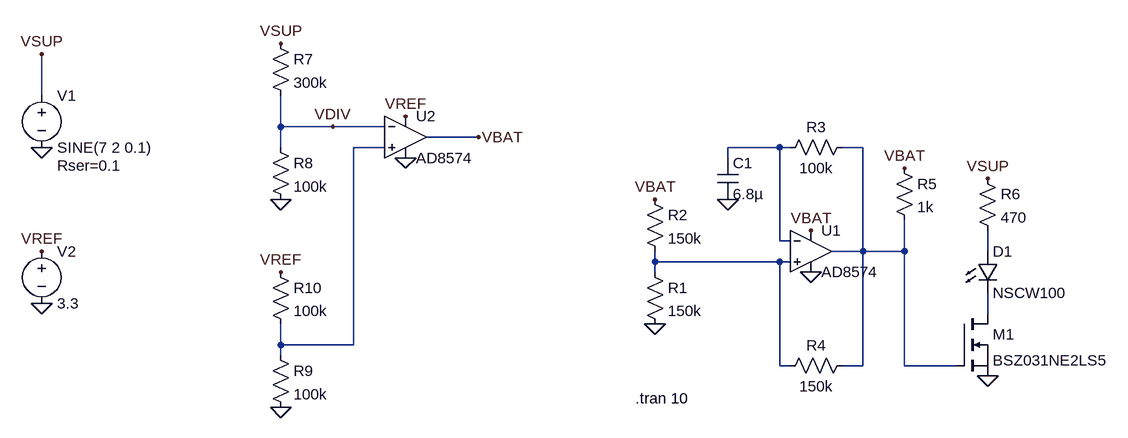
[diagram p0: schematic Low Battery.asc]
Low Battery.asc, the LTspice schematic file:
Version 4
SHEET 1 880 680
WIRE -992 -64 -992 -128
WIRE -624 -16 -624 -64
WIRE -544 -16 -624 -16
WIRE -464 -16 -544 -16
WIRE -320 0 -400 0
WIRE -624 16 -624 -16
WIRE -464 16 -512 16
WIRE 144 16 64 16
WIRE 160 16 144 16
WIRE 272 16 240 16
WIRE 64 32 64 16
WIRE 144 160 144 16
WIRE 160 160 144 160
WIRE 272 176 272 16
WIRE 272 176 224 176
WIRE 336 176 336 128
WIRE 336 176 272 176
WIRE 464 176 464 144
WIRE -48 192 -48 176
WIRE 144 192 -48 192
WIRE 160 192 144 192
WIRE -48 208 -48 192
WIRE 464 272 464 240
WIRE -624 320 -624 288
WIRE -512 320 -512 16
WIRE -512 320 -624 320
WIRE -624 336 -624 320
WIRE 144 352 144 192
WIRE 160 352 144 352
WIRE 272 352 272 176
WIRE 272 352 240 352
WIRE 336 352 336 176
WIRE 416 352 336 352
FLAG -48 288 0
FLAG 64 96 0
FLAG -48 96 VBAT
FLAG 192 144 VBAT
FLAG 192 208 0
FLAG 336 48 VBAT
FLAG -992 16 0
FLAG -992 -128 VSUP
FLAG 464 368 0
FLAG 464 64 VSUP
FLAG -992 256 0
FLAG -992 176 VREF
FLAG -624 96 0
FLAG -432 -32 VREF
FLAG -432 32 0
FLAG -624 -144 VSUP
FLAG -320 0 VBAT
FLAG -544 -16 VDIV
FLAG -624 416 0
FLAG -624 208 VREF
SYMBOL res -64 192 R0
SYMATTR InstName R1
SYMATTR Value 150k
SYMBOL res -64 80 R0
SYMATTR InstName R2
SYMATTR Value 150k
SYMBOL res 256 0 R90
WINDOW 0 0 56 VBottom 2
WINDOW 3 32 56 VTop 2
SYMATTR InstName R3
SYMATTR Value 100k
SYMBOL res 256 336 R90
WINDOW 0 0 56 VBottom 2
WINDOW 3 32 56 VTop 2
SYMATTR InstName R4
SYMATTR Value 150k
SYMBOL res 320 32 R0
SYMATTR InstName R5
SYMATTR Value 1k
SYMBOL cap 48 32 R0
SYMATTR InstName C1
SYMATTR Value 6.8µ
SYMBOL voltage -992 -80 R0
WINDOW 123 0 0 Left 0
WINDOW 39 24 124 Left 2
SYMATTR InstName V1
SYMATTR Value SINE(7 2 0.1)
SYMATTR SpiceLine Rser=0.1
SYMBOL OpAmps\\AD8574 192 112 R0
SYMATTR InstName U1
SYMBOL nmos 416 272 R0
SYMATTR InstName M1
SYMATTR Value BSZ031NE2LS5
SYMBOL LED 448 176 R0
SYMATTR InstName D1
SYMATTR Value NSCW100
SYMBOL res 448 48 R0
SYMATTR InstName R6
SYMATTR Value 470
SYMBOL voltage -992 160 R0
WINDOW 123 0 0 Left 0
WINDOW 39 0 0 Left 0
SYMATTR InstName V2
SYMATTR Value 3.3
SYMBOL res -640 -160 R0
SYMATTR InstName R7
SYMATTR Value 300k
SYMBOL res -640 0 R0
SYMATTR InstName R8
SYMATTR Value 100k
SYMBOL OpAmps\\AD8574 -432 -64 R0
SYMATTR InstName U2
SYMBOL res -640 320 R0
SYMATTR InstName R9
SYMATTR Value 100k
SYMBOL res -640 192 R0
SYMATTR InstName R10
SYMATTR Value 100k
TEXT -78 402 Left 2 !.tran 10

The netlist it stands for:
* Low Battery.asc
R1 N005 0 150k
R2 VBAT N005 150k
R3 N003 N002 100k
R4 N003 N005 150k
R5 VBAT N003 1k
C1 N002 0 6.8µ
V1 VSUP 0 SINE(7 2 0.1) Rser=0.1
XU1 N005 N002 VBAT 0 N003 AD8574  ; pins In+ In- V+ V- OUT
M1 N006 N003 0 0 BSZ031NE2LS5
D1 N004 N006 NSCW100
R6 VSUP N004 470
V2 VREF 0 3.3
R7 VSUP VDIV 300k
R8 VDIV 0 100k
XU2 N001 VDIV VREF 0 VBAT AD8574  ; pins In+ In- V+ V- OUT
R9 N001 0 100k
R10 VREF N001 100k
.model D D
.lib standard.dio
.model NMOS NMOS
.model PMOS PMOS
.lib standard.mos
.tran 10
.backanno
.end